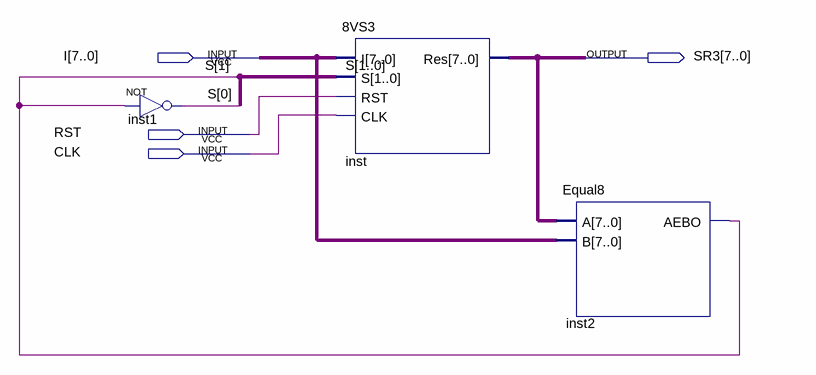
[diagram p0: schematic sheet]
// Quartus schematic 8SR3.bdf as structural Verilog: 3 symbols, 4 pins
module \8SR3  (
  input  [7:0] I,
  input  RST,
  input  CLK,
  output [7:0] SR3
);

  wire [1:0] S;

  not inst1 (S[0], S[1]);
  \8VS3  inst (.I(I), .S(S), .RST(RST), .CLK(CLK), .Res(SR3));
  Equal8 inst2 (.A(SR3), .B(I), .AEBO(S[1]));
endmodule
